# EAGLE design adb_converter (EAGLE 7.3.0)
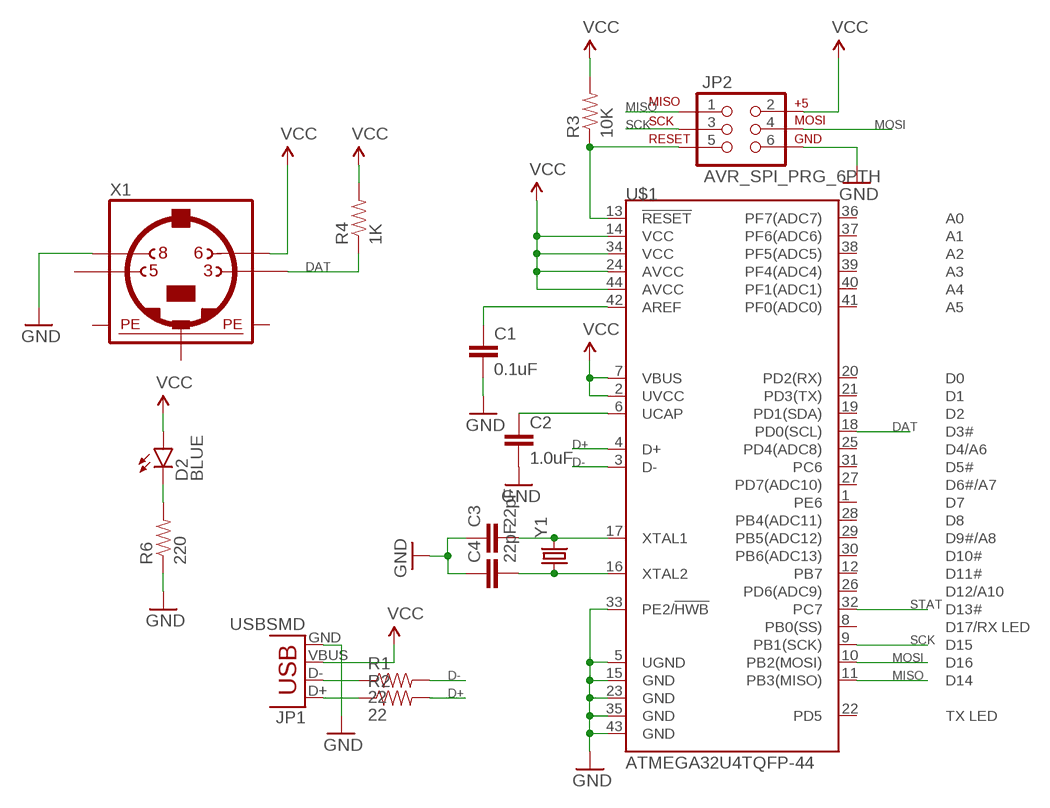
[diagram p0: schematic, sheet 1]

## Parts
C1  0.1uF  0.1UF-25V-5%(0603)  [0603-CAP]
C2  1.0uF  1.0UF-16V-10%(0603)  [0603-CAP]
C3  22pF  22PF-50V-5%(0603)  [0603-CAP]
C4  22pF  22PF-50V-5%(0603)  [0603-CAP]
D2  BLUE  LED-BLUE0603  [LED-0603]
JP1  USBSMD  [USB-MINIB]
JP2  AVR_SPI_PRG_6PTH  [2X3]
R1  22  22OHM1/10W1%(0603)  [0603-RES]
R2  22  22OHM1/10W1%(0603)  [0603-RES]
R3  10K  10KOHM-1/10W-1%(0603)0603  [0603-RES]
R4  1K  1KOHM-1/10W-1%(0603)  [0603-RES]
R6  220  220OHM-1/10W-1%(0603)  [0603-RES]
U$1  ATMEGA32U4TQFP-44  [TQFP44]
X1  MINI_DIN_4  [M_DIN4]
Y1  CRYSTALHC49US  [HC49US]

## Nets
D+: R2.2 U$1.4(D+)
D-: R1.2 U$1.3(D-)
DAT: R4.1 U$1.18(PD0(SCL)) X1.3
GND: C1.2 C2.2 C3.1 C4.1 JP1.GND JP2.6 R6.1 U$1.5(UGND) U$1.15(GND) U$1.23(GND) U$1.33(PE2/!HWB) U$1.35(GND) U$1.43(GND) X1.8
MISO: JP2.1 U$1.11(PB3(MISO))
MOSI: JP2.4 U$1.10(PB2(MOSI))
N$1: JP1.D- R1.1
N$2: JP1.D+ R2.1
N$3: JP2.5 R3.1 U$1.13(!RESET)
N$4: C1.1 U$1.42(AREF)
N$5: C2.1 U$1.6(UCAP)
N$6: C3.2 U$1.17(XTAL1) Y1.2
N$7: C4.2 U$1.16(XTAL2) Y1.1
N$9: D2.C R6.2
SCK: JP2.3 U$1.9(PB1(SCK))
STAT: U$1.32(PC7)
VCC: D2.A JP1.VBUS JP2.2 R3.2 R4.2 U$1.2(UVCC) U$1.7(VBUS) U$1.14(VCC) U$1.24(AVCC) U$1.34(VCC) U$1.44(AVCC) X1.6
Unconnected: U$1.1(PE6) U$1.8(PB0(SS)) U$1.12(PB7) U$1.19(PD1(SDA)) U$1.20(PD2(RX)) U$1.21(PD3(TX)) U$1.22(PD5) U$1.25(PD4(ADC8)) U$1.26(PD6(ADC9)) U$1.27(PD7(ADC10)) U$1.28(PB4(ADC11)) U$1.29(PB5(ADC12)) U$1.30(PB6(ADC13)) U$1.31(PC6) U$1.36(PF7(ADC7)) U$1.37(PF6(ADC6)) U$1.38(PF5(ADC5)) U$1.39(PF4(ADC4)) U$1.40(PF1(ADC1)) U$1.41(PF0(ADC0)) X1.5

## Power pins joined to a net without a drawn wire
PE1: X1.SH1(PE1)
PE2: X1.SH2(PE2)
PE3: X1.SH3(PE3)

## Library data of the parts
C1 = SparkFun-Capacitors:0.1UF-25V-5%(0603): CAP-08604; PROD_ID: CAP-08604
C2 = SparkFun-Capacitors:1.0UF-16V-10%(0603): CAP-00868; PROD_ID: CAP-00868
C3 C4 = SparkFun-Capacitors:22PF-50V-5%(0603): CAP-07876; PROD_ID: CAP-07876
D2 = SparkFun-LED:LED-BLUE: Blue LEDs for production use Various blue LEDs stocked by SparkFun production 0603 - DIO-08575 Rebel - DIO-09553 1206 - DIO-09911; PROD_ID: DIO-08575
JP1 = SparkFun-Connectors:USB: USB Connectors USB-B-PTH is fully proven SKU : PRT-00139/CONN-08278 USB-miniB is fully proven SKU : PRT-00587 USB-A-PCB is untested. USB-A-H is throughly reviewed, but untested. Spark Fun Electronics SKU : PRT-00437 USB-B-SMT is throughly reviewed, but untested. Needs silkscreen touching up. USB-A-S has not been used/tested USB-MB-H has not been used/tested USB-MICROB has been used. CONN-09505; PROD_ID: CONN-08193
JP2 = SparkFun-Connectors:AVR_SPI_PRG_6: AVR ISP 6 Pin This is the reduced ISP connector for AVR programming. Common on Arduino. This footprint will take up less PCB space and can be used with a 10-pin to 6-pin adapter such as SKU: BOB-08508 **Special note about "TEST_POINT" package. The stop mask is on the top side, so if you want your programming test points to be on the bottom of your board, make sure to place this package on the bottom side of the board. This also ensure that the orientation to program from the bottom side will be correct.
R1 R2 = SparkFun-Resistors:22OHM1/10W1%(0603): RES-08698; PROD_ID: RES-08698
R3 = SparkFun-Resistors:10KOHM-1/10W-1%(0603): RES-00824; PROD_ID: RES-00824
R4 = SparkFun-Resistors:1KOHM-1/10W-1%(0603): RES-07856; PROD_ID: RES-07856
R6 = SparkFun-Resistors:220OHM-1/10W-1%(0603): RES-07861; PROD_ID: RES-07861
U$1 = SparkFun-DigitalIC:ATMEGA32U4: Atmel 44-pin 8-bit Microcontroller with 32KBytes of ISP Flash and USB Controller
X1 = mini_din:MINI_DIN_4
Y1 = SparkFun-FreqCtrl:CRYSTAL: Various standard crystals. Proven footprints.

## Board
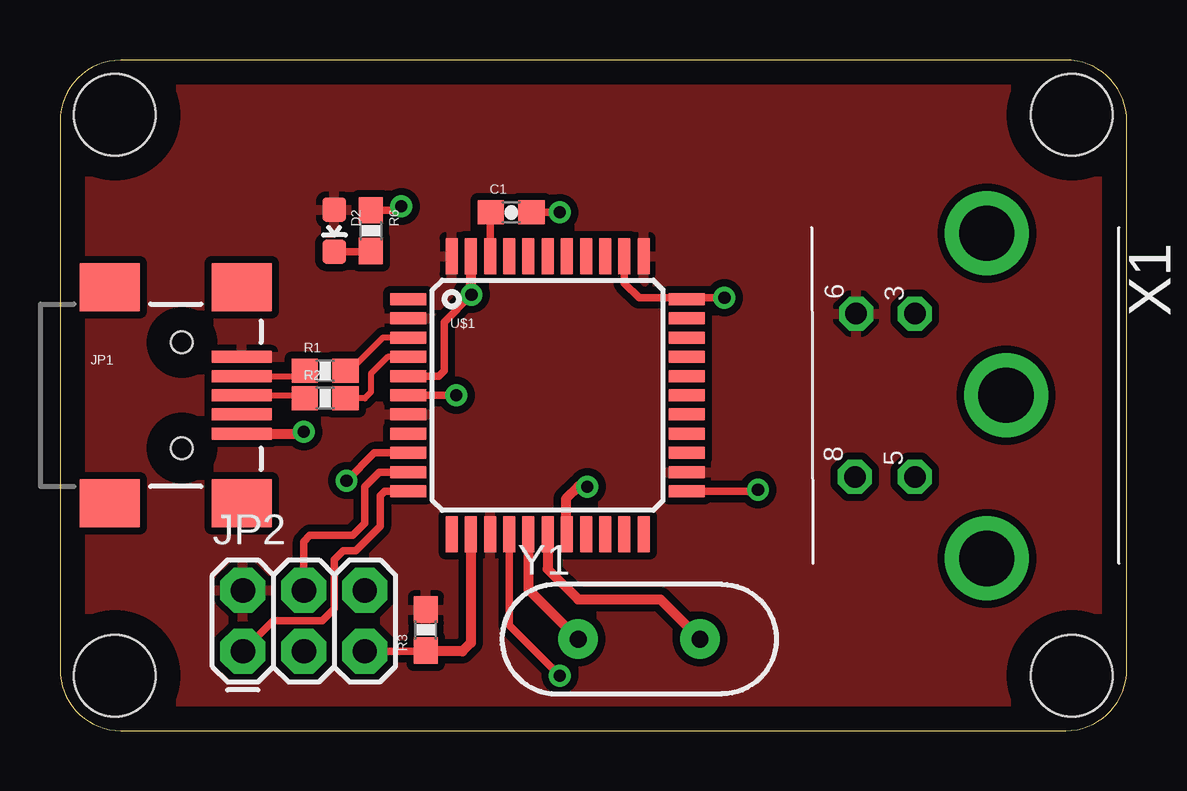
[diagram p1: board, top side]
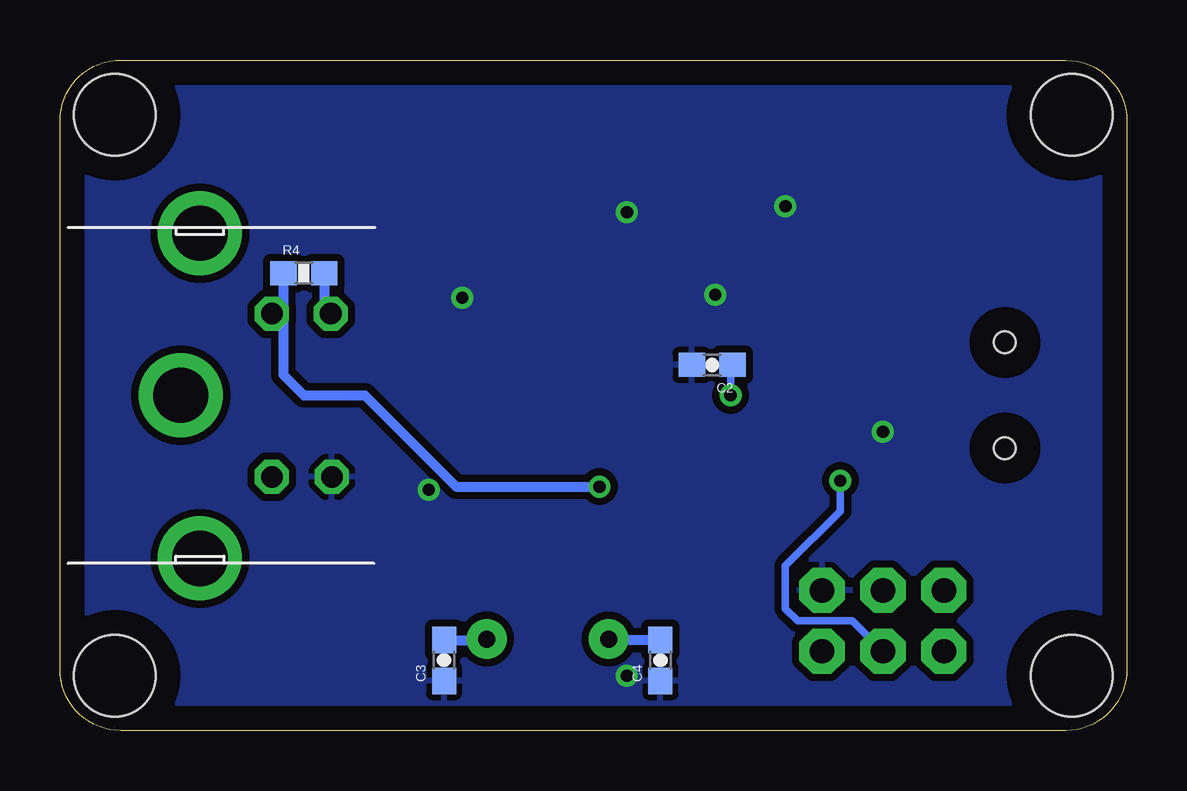
[diagram p2: board, bottom side, seen from below]

Size 44.45 x 27.94 mm. Coordinates in mm from the lower left corner, seen from the top.
Outline: 0,25.39 0,2.54 arc90 2.54,0 41.91,0 arc90 44.45,2.54 44.45,25.4 arc90 41.91,27.94 2.54,27.93 arc90 0,25.39
Copper layers (1*16): Top 0.035mm / dielectric 1.5mm / Bottom 0.035mm
Design rules "default": minimum track width 10mil, minimum drill 24mil, track to track 8mil, track to pad 8mil, pad to pad 8mil, via to via 8mil, smd to smd 8mil, copper to edge 40mil, drill to drill 8mil, minimum pad ring 10mil, minimum via ring 8mil, stop-mask expansion 4mil, vias tented up to drill 0mil, thermal gap 10mil
Holes 3.4 mm at 2.29,25.65 2.29,2.29 42.16,2.29 42.16,25.65

### Footprints (pad centres in the part's own frame; a part is rotated, then mirrored left to right if it is on the bottom)
0603-CAP = smd 1.1 x 1: 1 -0.85,0; 2 0.85,0
LED-0603 = smd 1 x 1: A 0,-0.877; C 0,0.877
USB-MINIB = smd 2.5 x 0.5: D+ 2.5,0; D- 2.5,0.8; GND 2.5,-1.6; ID 2.5,-0.8; VBUS 2.5,1.6 | smd 2.5 x 2: MTN1 -3,4.5; MTN2 2.5,4.5; MTN3 -3,-4.5; MTN4 2.5,-4.5 | hole 0.9: 0,2.2; 0,-2.2
2X3 = drill 1.016 pad 1.88 octagon: 1 0,0; 2 0,2.54; 3 2.54,0; 4 2.54,2.54; 5 5.08,0; 6 5.08,2.54
0603-RES = smd 1.1 x 1: 1 -0.85,0; 2 0.85,0
TQFP44 = smd 1.5 x 0.5: 1 -5.8,4; 2 -5.8,3.2; 3 -5.8,2.4; 4 -5.8,1.6; 5 -5.8,0.8; 6 -5.8,0; 7 -5.8,-0.8; 8 -5.8,-1.6; 9 -5.8,-2.4; 10 -5.8,-3.2; 11 -5.8,-4; 23 5.8,-4; 24 5.8,-3.2; 25 5.8,-2.4; 26 5.8,-1.6; 27 5.8,-0.8; 28 5.8,0; 29 5.8,0.8; 30 5.8,1.6; 31 5.8,2.4; 32 5.8,3.2; 33 5.8,4 | smd 0.5 x 1.5: 12 -4,-5.8; 13 -3.2,-5.8; 14 -2.4,-5.8; 15 -1.6,-5.8; 16 -0.8,-5.8; 17 0,-5.8; 18 0.8,-5.8; 19 1.6,-5.8; 20 2.4,-5.8; 21 3.2,-5.8; 22 4,-5.8; 34 4,5.8; 35 3.2,5.8; 36 2.4,5.8; 37 1.6,5.8; 38 0.8,5.8; 39 0,5.8; 40 -0.8,5.8; 41 -1.6,5.8; 42 -2.4,5.8; 43 -3.2,5.8; 44 -4,5.8
M_DIN4 = drill 0.9 pad 1.422 octagon: 3 -3.4,-3.75; 5 3.4,-3.75; 6 -3.4,-6.2; 8 3.4,-6.25 | drill 2.3 pad 3.5: SH1 6.8,-0.75; SH2 0,0.05; SH3 -6.75,-0.75
HC49US = drill 0.7 pad 1.651: 1 -2.54,0; 2 2.54,0

### Placement (x,y rotation side)
C1  18.8,21.59 0 top
C2  17.27,15.24 180 bottom
C3  28.45,2.92 90 bottom
C4  19.43,2.92 90 bottom
D2  11.43,20.83 180 top
JP1  5.08,13.97 0 top
JP2  7.62,3.3 0 top
R1  11.05,14.99 0 top
R2  11.05,13.84 0 top
R3  15.24,4.19 90 top
R4  34.29,19.05 0 bottom
R6  12.95,20.83 270 top
U$1  20.32,13.97 0 top
X1  39.37,13.97 270 top
Y1  24.13,3.81 0 top

### Tracks (layer width: path | path; a pad name or v marks a point on that pad's centre or on a via)
D+
  Top 0.254: U$1.4 13.66,15.57 12.95,14.86 12.95,14.1 12.7,13.84 R2.2
D-
  Top 0.254: R1.2 12.06,14.99 13.46,16.38 14.51,16.38 U$1.3
DAT  (via drill 0.51)
  Top 0.406: v21.97,10.16 21.59,10.16 21.08,9.65 21.08,8.21 U$1.18
  Bottom 0.406: R4.1 35.14,17.85 | 35.14,17.85 X1.3 | 35.14,17.85 35.14,14.82 34.29,13.97 31.75,13.97 27.94,10.16 v21.97,10.16
GND  (via drill 0.51)
  Top 0.305: U$1.15 18.72,4.39 v20.83,2.29 | U$1.35 23.52,18.64 24.13,18.03 26.06,18.03 | 26.06,18.03 U$1.33 | 26.06,18.03 v27.69,18.03 | U$1.5 15.79,14.77 16,14.99 16,17.02 v17.14,18.16 | U$1.23 29.02,9.97 v29.08,10.03 | C1.2 v20.83,21.59 | R6.1 14.06,21.68 v14.22,21.84
  Top 0.406: JP1.GND 10.08,12.37 v10.16,12.45 | U$1.43 17.12,18.19 v17.14,18.16
  pour Bottom (isolate 0.305): -2.54,29.21 -2.54,-2.54 46.99,-2.54 46.99,30.48 -2.54,30.48
MISO
  Top 0.305: U$1.11 13.53,9.97 13.34,9.78 13.34,8.51 12.32,7.49 11.81,7.49 11.43,7.11 11.43,5.08 10.92,4.57 8.89,4.57 JP2.1
MOSI
  Top 0.305: JP2.4 10.16,7.87 10.41,8.13 12.19,8.13 12.7,8.64 12.7,10.16 13.31,10.77 U$1.10
N$1
  Top 0.254: JP1.D- 9.98,14.77 R1.1
N$2
  Top 0.254: JP1.D+ 10.07,13.97 R2.1
N$3
  Top 0.305: JP2.5 15.2,3.3 R3.1
  Top 0.406: U$1.13 17.12,3.66 16.76,3.3 15.28,3.3 R3.1
N$4
  Top 0.305: U$1.42 17.92,21.56 C1.1
N$5  (via drill 0.51)
  Top 0.305: U$1.6 v16.51,13.97
  Bottom 0.305: v16.51,13.97 16.51,15.15 C2.1
N$6
  Top 0.406: U$1.17 20.32,6.73 21.59,5.46 25.02,5.46 Y1.2
  Bottom 0.406: C3.2 26.71,3.77 Y1.2
N$7
  Top 0.406: U$1.16 19.52,5.88 Y1.1
  Bottom 0.406: C4.2 21.55,3.77 Y1.1
N$9
  Top 0.305: D2.C 12.93,19.95 R6.2
SCK  (via drill 0.51)
  Top 0.305: U$1.9 13.09,11.57 v11.94,10.41
  Bottom 0.305: v11.94,10.41 11.94,9.14 14.22,6.86 14.22,5.08 13.72,4.57 11.43,4.57 JP2.3
VCC
  Bottom 0.406: R4.2 33.44,17.64 X1.6
  pour Top (isolate 0.305): -3.81,30.48 -3.81,-3.81 48.26,-3.81 48.26,31.75 -3.81,31.75